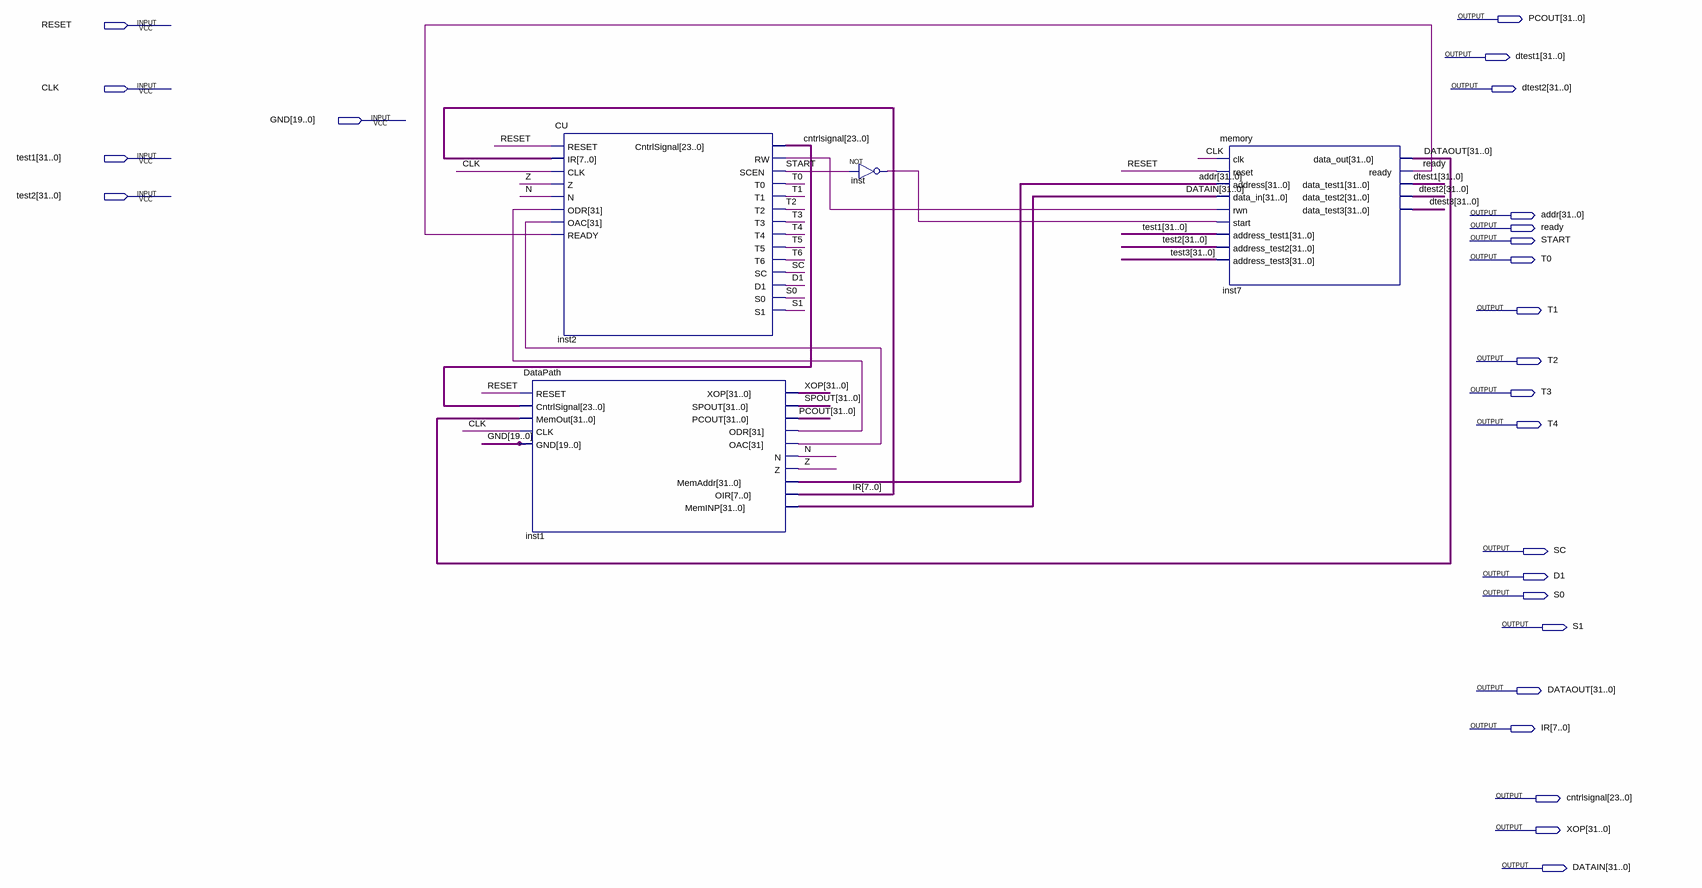
[diagram p0: schematic sheet]
// Quartus schematic DesignCPU.bdf as structural Verilog: 4 symbols, 25 pins
module DesignCPU (
  input  RESET,
  input  CLK,
  input  [19:0] GND,
  input  [31:0] test1,
  input  [31:0] test2,
  output [31:0] PCOUT,
  output [31:0] dtest1,
  output [31:0] dtest2,
  output [31:0] addr,
  output ready,
  output START,
  output T0,
  output T1,
  output T2,
  output T3,
  output T4,
  output SC,
  output D1,
  output S0,
  output S1,
  output [31:0] DATAOUT,
  output [7:0] IR,
  output [23:0] cntrlsignal,
  output [31:0] XOP,
  output [31:0] DATAIN
);

  wire inst1_oac, inst1_odr, inst2_rw, inst_out, N, T5, T6, Z;
  wire [31:0] dtest3, SPOUT, test3;

  DataPath inst1 (
    .RESET(RESET), .CntrlSignal(cntrlsignal), .MemOut(DATAOUT), .CLK(CLK), .GND(GND), .XOP(XOP),
    .SPOUT(SPOUT), .PCOUT(PCOUT), .ODR(inst1_odr), .OAC(inst1_oac), .N(N), .Z(Z), .MemAddr(addr), .OIR(IR),
    .MemINP(DATAIN));
  CU inst2 (
    .RESET(RESET), .IR(IR), .CLK(CLK), .Z(Z), .N(N), .ODR(inst1_odr), .OAC(inst1_oac), .READY(ready),
    .CntrlSignal(cntrlsignal), .RW(inst2_rw), .SCEN(START), .T0(T0), .T1(T1), .T2(T2), .T3(T3), .T4(T4),
    .T5(T5), .T6(T6), .SC(SC), .D1(D1), .S0(S0), .S1(S1));
  not inst (inst_out, START);
  memory inst7 (
    .clk(CLK), .reset(RESET), .address(addr), .data_in(DATAIN), .rwn(inst2_rw), .start(inst_out),
    .address_test1(test1), .address_test2(test2), .address_test3(test3), .data_out(DATAOUT), .ready(ready),
    .data_test1(dtest1), .data_test2(dtest2), .data_test3(dtest3));
endmodule
